# EAGLE design TAStm32 (EAGLE 9.1.3)
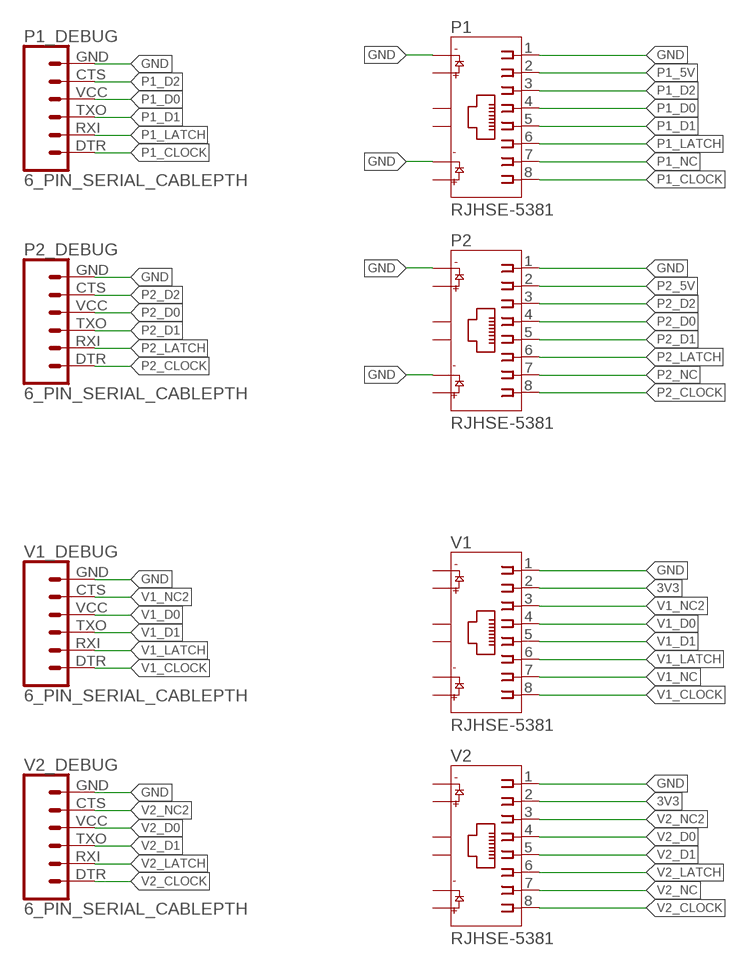
[diagram p0: schematic, sheet 1, part 1 of 2]
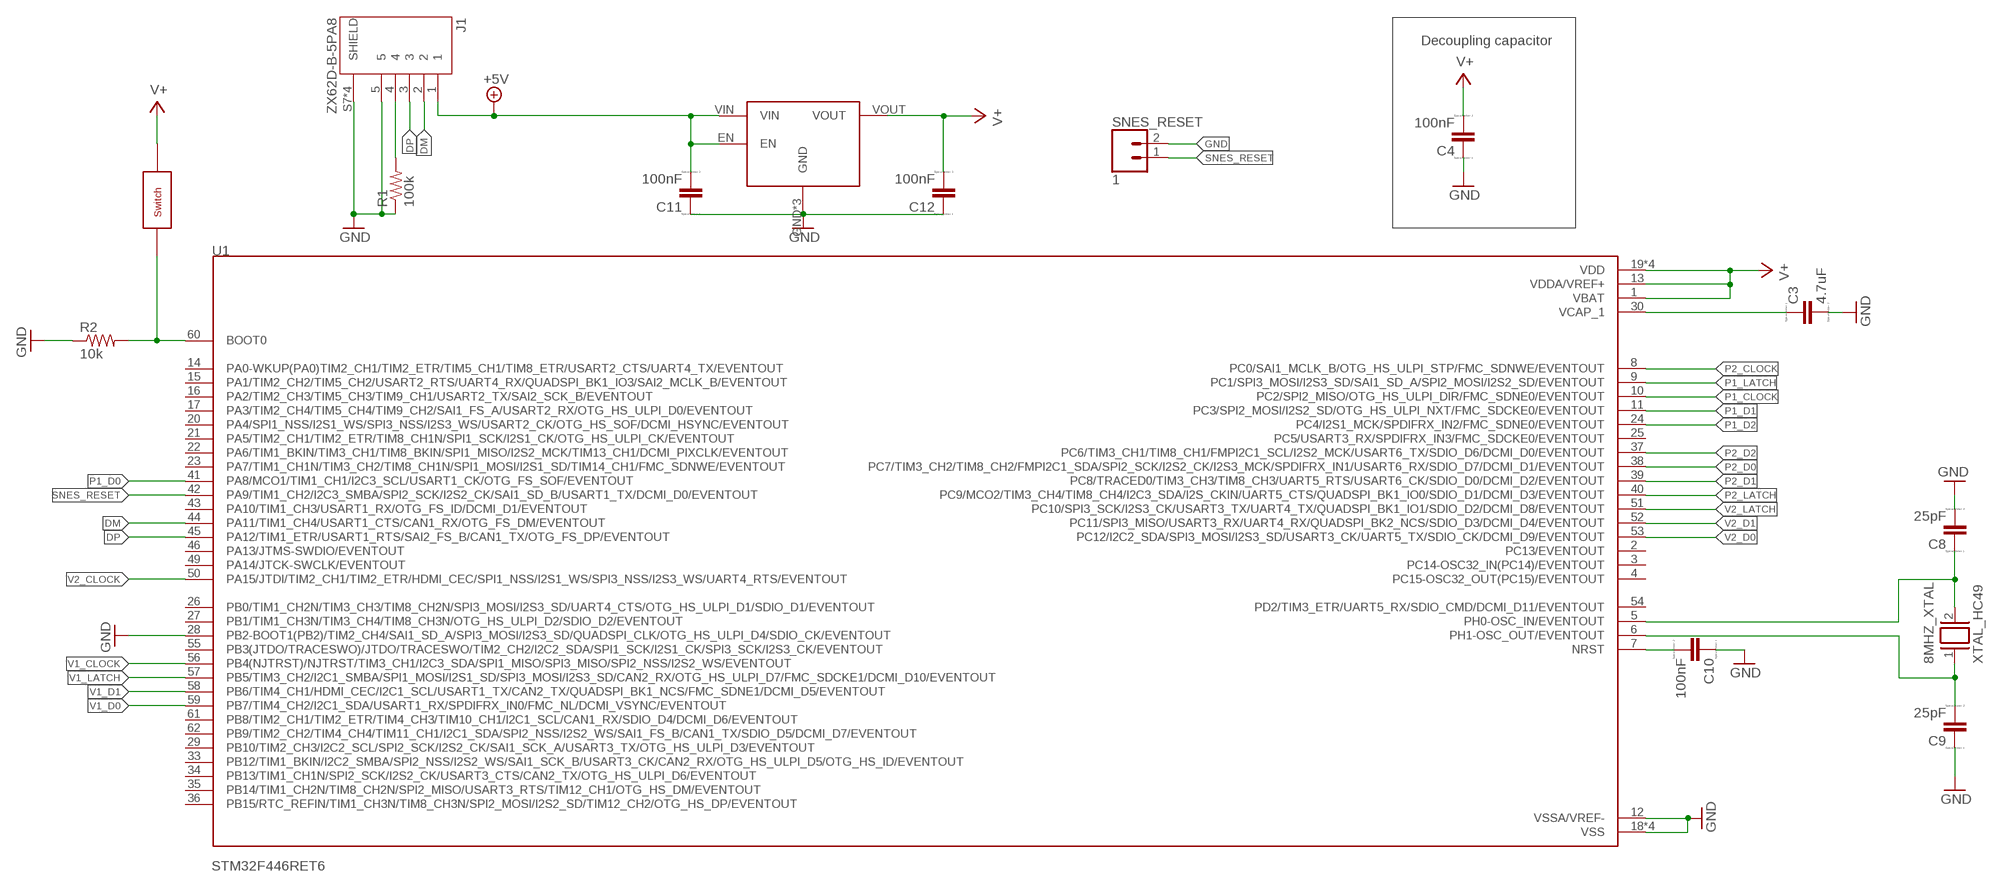
[diagram p1: schematic, sheet 1, part 2 of 2]

## Parts
8MHZ_XTAL  XTAL_HC49  [XTAL_HC49P488W45L1150T500H350]
C3  4.7uF  C  [C0805]
C4  100nF  C  [C0805]
C8  25pF  C  [C0805]
C9  25pF  C  [C0805]
C10  100nF  C  [C0805]
C11  100nF  C  [C0805]
C12  100nF  C  [C0805]
J1  ZX62D-B-5PA8  [HIROSE_ZX62D-B-5PA8]
P1  RJHSE-5381  [AMPHENOL_RJHSE-5381]
P1_DEBUG  6_PIN_SERIAL_CABLEPTH  [FTDI_BASIC]
P2  RJHSE-5381  [AMPHENOL_RJHSE-5381]
P2_DEBUG  6_PIN_SERIAL_CABLEPTH  [FTDI_BASIC]
R1  100k  R-US_R0805  [R0805]
R2  10k  R-US_R0805  [R0805]
SNES_RESET  1  CONN_02  [1X02]
SWITCH  DM01  [DM01]
U1  STM32F446RET6  [QFP50P1200X1200X160-64N]
V1  RJHSE-5381  [AMPHENOL_RJHSE-5381]
V1_DEBUG  6_PIN_SERIAL_CABLEPTH  [FTDI_BASIC]
V2  RJHSE-5381  [AMPHENOL_RJHSE-5381]
V2_DEBUG  6_PIN_SERIAL_CABLEPTH  [FTDI_BASIC]
V_REG  S-1172B33-U5T1G  [S-1172B33-U5T1G]

## Nets
3V3: C4.2 C12.2 SWITCH.P$1 U1.1(VBAT) U1.13(VDDA/VREF+) U1.19(VDD) U1.32(VDD) U1.48(VDD) U1.64(VDD) V1.2 V2.2 V_REG.VOUT ; supply symbol labelled V+
+5V: C11.2 J1.1 V_REG.EN V_REG.VIN
DM: J1.2 U1.44(PA11/TIM1_CH4/USART1_CTS/CAN1_RX/OTG_FS_DM/EVENTOUT)
DP: J1.3 U1.45(PA12/TIM1_ETR/USART1_RTS/SAI2_FS_B/CAN1_TX/OTG_FS_DP/EVENTOUT)
GND: C3.2 C4.1 C8.2 C9.1 C10.1 C11.1 C12.1 J1.5 J1.S7(SHIELD) J1.S8(SHIELD) J1.S9(SHIELD) J1.S10(SHIELD) P1.1 P1.9 P1.11 P1_DEBUG.GND P2.1 P2.9 P2.11 P2_DEBUG.GND R1.1 R2.1 SNES_RESET.2 U1.12(VSSA/VREF-) U1.18(VSS) U1.28(PB2-BOOT1(PB2)/TIM2_CH4/SAI1_SD_A/SPI3_MOSI/I2S3_SD/QUADSPI_CLK/OTG_HS_ULPI_D4/SDIO_CK/EVENTOUT) U1.31(VSS) U1.47(VSS) U1.63(VSS) V1.1 V1_DEBUG.GND V2.1 V2_DEBUG.GND V_REG.GND V_REG.GND2(GND) V_REG.GND3(GND)
N$3: R2.2 SWITCH.P$2 U1.60(BOOT0)
N$4: C10.2 U1.7(NRST)
N$6: C3.1 U1.30(VCAP_1)
N$15: J1.4 R1.2
P1_5V: P1.2
P1_CLOCK: P1.8 P1_DEBUG.DTR U1.10(PC2/SPI2_MISO/OTG_HS_ULPI_DIR/FMC_SDNE0/EVENTOUT)
P1_D0: P1.4 P1_DEBUG.VCC U1.41(PA8/MCO1/TIM1_CH1/I2C3_SCL/USART1_CK/OTG_FS_SOF/EVENTOUT)
P1_D1: P1.5 P1_DEBUG.TXO U1.11(PC3/SPI2_MOSI/I2S2_SD/OTG_HS_ULPI_NXT/FMC_SDCKE0/EVENTOUT)
P1_D2: P1.3 P1_DEBUG.CTS U1.24(PC4/I2S1_MCK/SPDIFRX_IN2/FMC_SDNE0/EVENTOUT)
P1_LATCH: P1.6 P1_DEBUG.RXI U1.9(PC1/SPI3_MOSI/I2S3_SD/SAI1_SD_A/SPI2_MOSI/I2S2_SD/EVENTOUT)
P1_NC: P1.7
P2_5V: P2.2
P2_CLOCK: P2.8 P2_DEBUG.DTR U1.8(PC0/SAI1_MCLK_B/OTG_HS_ULPI_STP/FMC_SDNWE/EVENTOUT)
P2_D0: P2.4 P2_DEBUG.VCC U1.38(PC7/TIM3_CH2/TIM8_CH2/FMPI2C1_SDA/SPI2_SCK/I2S2_CK/I2S3_MCK/SPDIFRX_IN1/USART6_RX/SDIO_D7/DCMI_D1/EVENTOUT)
P2_D1: P2.5 P2_DEBUG.TXO U1.39(PC8/TRACED0/TIM3_CH3/TIM8_CH3/UART5_RTS/USART6_CK/SDIO_D0/DCMI_D2/EVENTOUT)
P2_D2: P2.3 P2_DEBUG.CTS U1.37(PC6/TIM3_CH1/TIM8_CH1/FMPI2C1_SCL/I2S2_MCK/USART6_TX/SDIO_D6/DCMI_D0/EVENTOUT)
P2_LATCH: P2.6 P2_DEBUG.RXI U1.40(PC9/MCO2/TIM3_CH4/TIM8_CH4/I2C3_SDA/I2S_CKIN/UART5_CTS/QUADSPI_BK1_IO0/SDIO_D1/DCMI_D3/EVENTOUT)
P2_NC: P2.7
SNES_RESET: SNES_RESET.1 U1.42(PA9/TIM1_CH2/I2C3_SMBA/SPI2_SCK/I2S2_CK/SAI1_SD_B/USART1_TX/DCMI_D0/EVENTOUT)
V1_CLOCK: U1.56(PB4(NJTRST)/NJTRST/TIM3_CH1/I2C3_SDA/SPI1_MISO/SPI3_MISO/SPI2_NSS/I2S2_WS/EVENTOUT) V1.8 V1_DEBUG.DTR
V1_D0: U1.59(PB7/TIM4_CH2/I2C1_SDA/USART1_RX/SPDIFRX_IN0/FMC_NL/DCMI_VSYNC/EVENTOUT) V1.4 V1_DEBUG.VCC
V1_D1: U1.58(PB6/TIM4_CH1/HDMI_CEC/I2C1_SCL/USART1_TX/CAN2_TX/QUADSPI_BK1_NCS/FMC_SDNE1/DCMI_D5/EVENTOUT) V1.5 V1_DEBUG.TXO
V1_LATCH: U1.57(PB5/TIM3_CH2/I2C1_SMBA/SPI1_MOSI/I2S1_SD/SPI3_MOSI/I2S3_SD/CAN2_RX/OTG_HS_ULPI_D7/FMC_SDCKE1/DCMI_D10/EVENTOUT) V1.6 V1_DEBUG.RXI
V1_NC: V1.7
V1_NC2: V1.3 V1_DEBUG.CTS
V2_CLOCK: U1.50(PA15/JTDI/TIM2_CH1/TIM2_ETR/HDMI_CEC/SPI1_NSS/I2S1_WS/SPI3_NSS/I2S3_WS/UART4_RTS/EVENTOUT) V2.8 V2_DEBUG.DTR
V2_D0: U1.53(PC12/I2C2_SDA/SPI3_MOSI/I2S3_SD/USART3_CK/UART5_TX/SDIO_CK/DCMI_D9/EVENTOUT) V2.4 V2_DEBUG.VCC
V2_D1: U1.52(PC11/SPI3_MISO/USART3_RX/UART4_RX/QUADSPI_BK2_NCS/SDIO_D3/DCMI_D4/EVENTOUT) V2.5 V2_DEBUG.TXO
V2_LATCH: U1.51(PC10/SPI3_SCK/I2S3_CK/USART3_TX/UART4_TX/QUADSPI_BK1_IO1/SDIO_D2/DCMI_D8/EVENTOUT) V2.6 V2_DEBUG.RXI
V2_NC: V2.7
V2_NC2: V2.3 V2_DEBUG.CTS
XTAL1: 8MHZ_XTAL.2 C8.1 U1.5(PH0-OSC_IN/EVENTOUT)
XTAL2: 8MHZ_XTAL.1 C9.2 U1.6(PH1-OSC_OUT/EVENTOUT)
Unconnected: P1.10 P1.12 P1.S1 P1.S2 P2.10 P2.12 P2.S1 P2.S2 U1.2(PC13/EVENTOUT) U1.3(PC14-OSC32_IN(PC14)/EVENTOUT) U1.4(PC15-OSC32_OUT(PC15)/EVENTOUT) U1.14(PA0-WKUP(PA0)TIM2_CH1/TIM2_ETR/TIM5_CH1/TIM8_ETR/USART2_CTS/UART4_TX/EVENTOUT) U1.15(PA1/TIM2_CH2/TIM5_CH2/USART2_RTS/UART4_RX/QUADSPI_BK1_IO3/SAI2_MCLK_B/EVENTOUT) U1.16(PA2/TIM2_CH3/TIM5_CH3/TIM9_CH1/USART2_TX/SAI2_SCK_B/EVENTOUT) U1.17(PA3/TIM2_CH4/TIM5_CH4/TIM9_CH2/SAI1_FS_A/USART2_RX/OTG_HS_ULPI_D0/EVENTOUT) U1.20(PA4/SPI1_NSS/I2S1_WS/SPI3_NSS/I2S3_WS/USART2_CK/OTG_HS_SOF/DCMI_HSYNC/EVENTOUT) U1.21(PA5/TIM2_CH1/TIM2_ETR/TIM8_CH1N/SPI1_SCK/I2S1_CK/OTG_HS_ULPI_CK/EVENTOUT) U1.22(PA6/TIM1_BKIN/TIM3_CH1/TIM8_BKIN/SPI1_MISO/I2S2_MCK/TIM13_CH1/DCMI_PIXCLK/EVENTOUT) U1.23(PA7/TIM1_CH1N/TIM3_CH2/TIM8_CH1N/SPI1_MOSI/I2S1_SD/TIM14_CH1/FMC_SDNWE/EVENTOUT) U1.25(PC5/USART3_RX/SPDIFRX_IN3/FMC_SDCKE0/EVENTOUT) U1.26(PB0/TIM1_CH2N/TIM3_CH3/TIM8_CH2N/SPI3_MOSI/I2S3_SD/UART4_CTS/OTG_HS_ULPI_D1/SDIO_D1/EVENTOUT) U1.27(PB1/TIM1_CH3N/TIM3_CH4/TIM8_CH3N/OTG_HS_ULPI_D2/SDIO_D2/EVENTOUT) U1.29(PB10/TIM2_CH3/I2C2_SCL/SPI2_SCK/I2S2_CK/SAI1_SCK_A/USART3_TX/OTG_HS_ULPI_D3/EVENTOUT) U1.33(PB12/TIM1_BKIN/I2C2_SMBA/SPI2_NSS/I2S2_WS/SAI1_SCK_B/USART3_CK/CAN2_RX/OTG_HS_ULPI_D5/OTG_HS_ID/EVENTOUT) U1.34(PB13/TIM1_CH1N/SPI2_SCK/I2S2_CK/USART3_CTS/CAN2_TX/OTG_HS_ULPI_D6/EVENTOUT) U1.35(PB14/TIM1_CH2N/TIM8_CH2N/SPI2_MISO/USART3_RTS/TIM12_CH1/OTG_HS_DM/EVENTOUT) U1.36(PB15/RTC_REFIN/TIM1_CH3N/TIM8_CH3N/SPI2_MOSI/I2S2_SD/TIM12_CH2/OTG_HS_DP/EVENTOUT) U1.43(PA10/TIM1_CH3/USART1_RX/OTG_FS_ID/DCMI_D1/EVENTOUT) U1.46(PA13/JTMS-SWDIO/EVENTOUT) U1.49(PA14/JTCK-SWCLK/EVENTOUT) U1.54(PD2/TIM3_ETR/UART5_RX/SDIO_CMD/DCMI_D11/EVENTOUT) U1.55(PB3(JTDO/TRACESWO)/JTDO/TRACESWO/TIM2_CH2/I2C2_SDA/SPI1_SCK/I2S1_CK/SPI3_SCK/I2S3_CK/EVENTOUT) U1.61(PB8/TIM2_CH1/TIM2_ETR/TIM4_CH3/TIM10_CH1/I2C1_SCL/CAN1_RX/SDIO_D4/DCMI_D6/EVENTOUT) U1.62(PB9/TIM2_CH2/TIM4_CH4/TIM11_CH1/I2C1_SDA/SPI2_NSS/I2S2_WS/SAI1_FS_B/CAN1_TX/SDIO_D5/DCMI_D7/EVENTOUT) V1.9 V1.10 V1.11 V1.12 V1.S1 V1.S2 V2.9 V2.10 V2.11 V2.12 V2.S1 V2.S2

## Notes on the sheet
- Decoupling capacitor

## Library data of the parts
8MHZ_XTAL = XTAL_HC49P488W45L1150T500H350:XTAL_HC49
C3 C4 C8-C12 = eagle-ltspice:C: CAPACITOR, European symbol; SPICEMODEL: NONE; SPICEPREFIX: C
J1 = ZX62D-B-5PA8:ZX62D-B-5PA8: CONN RCPT USB; AVAILABILITY: Unavailable; DESCRIPTION: 5 Pin Single Port USB 2.0 Micro B Bottom Mount Through Hole Receptacle Male; MF: Hirose; MP: ZX62D-B-5PA8; PACKAGE: None; PRICE: None
P1 P2 V1 V2 = RJHSE-5381:RJHSE-5381: connector, mod jack, rt angle pcb, shielded, led1-g, led2-y, single port, rj-45 8 cont; AVAILABILITY: Unavailable; DESCRIPTION: connector, mod jack, rt angle pcb, shielded, led1-g, led2-y, single port, rj-45 8 cont; MF: Amphenol ICC; MP: RJHSE-5381; PACKAGE: None; PRICE: None
P1_DEBUG P2_DEBUG V1_DEBUG V2_DEBUG = SparkFun-Connectors:6_PIN_SERIAL_CABLE: 6-pin header connection for use with the "FTDI BASIC" pinout - CABLE SIDE. Also known as "Arduino Serial Program Header". This is used on a design to provide a 6-pin connection point for serial communication usually from a USB cable (D+/D-) to these headers (RX/TX). It also has the remaining pins necessary for programming in the Arduino evironment (DTR, GND, and sometimes VCC). Note, this device has "CABLE" in the name. It is intended to be used on a design that usually lives on the end of your USB cable and prvides the converter chip (FTDI232 or FTDI231x) to commnicate serial RX/TX. The "sister" device, named "TARGET" is inteneded to be used on a design that contains a target micro-controller that you wish to program. You can populate with some of these: Female Headers <https://www.sparkfun.com/products/115> (PRT-00115) For reference (or to suit your programming needs) check out these designs: SparkFun FTDI Basic Breakout - 5V <https://www.sparkfun.com/products/9716> (DEV-09716) SparkFun FTDI Basic Breakout - 3.3V <https://www.sparkfun.com/products/9873> (DEV-09873) SparkFun FTDI SmartBasic <https://www.sparkfun.com/products/12935> (DEV-12935) SparkFun Beefy 3 - FTDI Basic Breakout <https://www.sparkfun.com/products/13746> (DEV-13746)
R1 R2 = rcl:R-US_: RESISTOR, American symbol; SPICEPREFIX: R
SNES_RESET = SparkFun-Connectors:CONN_02: Multi connection point. Often used as Generic Header-pin footprint for 0.1 inch spaced/style header connections On any of the 0.1 inch spaced packages, you can populate with these: Break Away Headers - Straight <https://www.sparkfun.com/products/116> (PRT-00116) Break Away Male Headers - Right Angle <https://www.sparkfun.com/products/553> (PRT-00553) Female Headers <https://www.sparkfun.com/products/115> (PRT-00115) Break Away Headers - Machine Pin <https://www.sparkfun.com/products/117> (PRT-00117) Break Away Female Headers - Swiss Machine Pin <https://www.sparkfun.com/products/743> (PRT-00743) For SCREWTERMINALS and SPRING TERMINALS visit here: Screw Terimnals on SparkFun.com <https://www.sparkfun.com/search/results?term=Screw+Terminals> (5mm/3.5mm/2.54mm spacing) This device is also useful as a general connection point to wire up your design to another part of your project. Our various solder wires solder well into these plated through hole pads. Hook-Up Wire - Assortment (Stranded, 22 AWG) <https://www.sparkfun.com/products/11375> (PRT-11375) Hook-Up Wire - Assortment (Solid Core, 22 AWG) <https://www.sparkfun.com/products/11367> (PRT-11367) View the entire wire category on our website here <https://www.sparkfun.com/categories/141> Special notes: Molex polarized connector foot print use with: PRT-08233 with associated crimp pins and housings. 2.54_SCREWTERM for use with PRT-10571. 3.5mm Screw Terminal footprints for PRT-08084 5mm Screw Terminal footprints for use with PRT-08432
SWITCH = DM01:DM01
U1 = STM32F446RET6:STM32F446RET6: MCU 32-Bit STM32 ARM Cortex M4 RISC 512KB Flash 2.5V/3.3V 64-Pin LQFP Tray; DESCRIPTION: MCU 32-Bit STM32 ARM Cortex M4 RISC 512KB Flash 2.5V/3.3V 64-Pin LQFP Tray; MF: STMicroelectronics; MP: STM32F446RET6; PACKAGE: LQFP-64 STMicroelectronics
V_REG = S-1172B33-U5T1G:S-1172B33-U5T1G

## Board
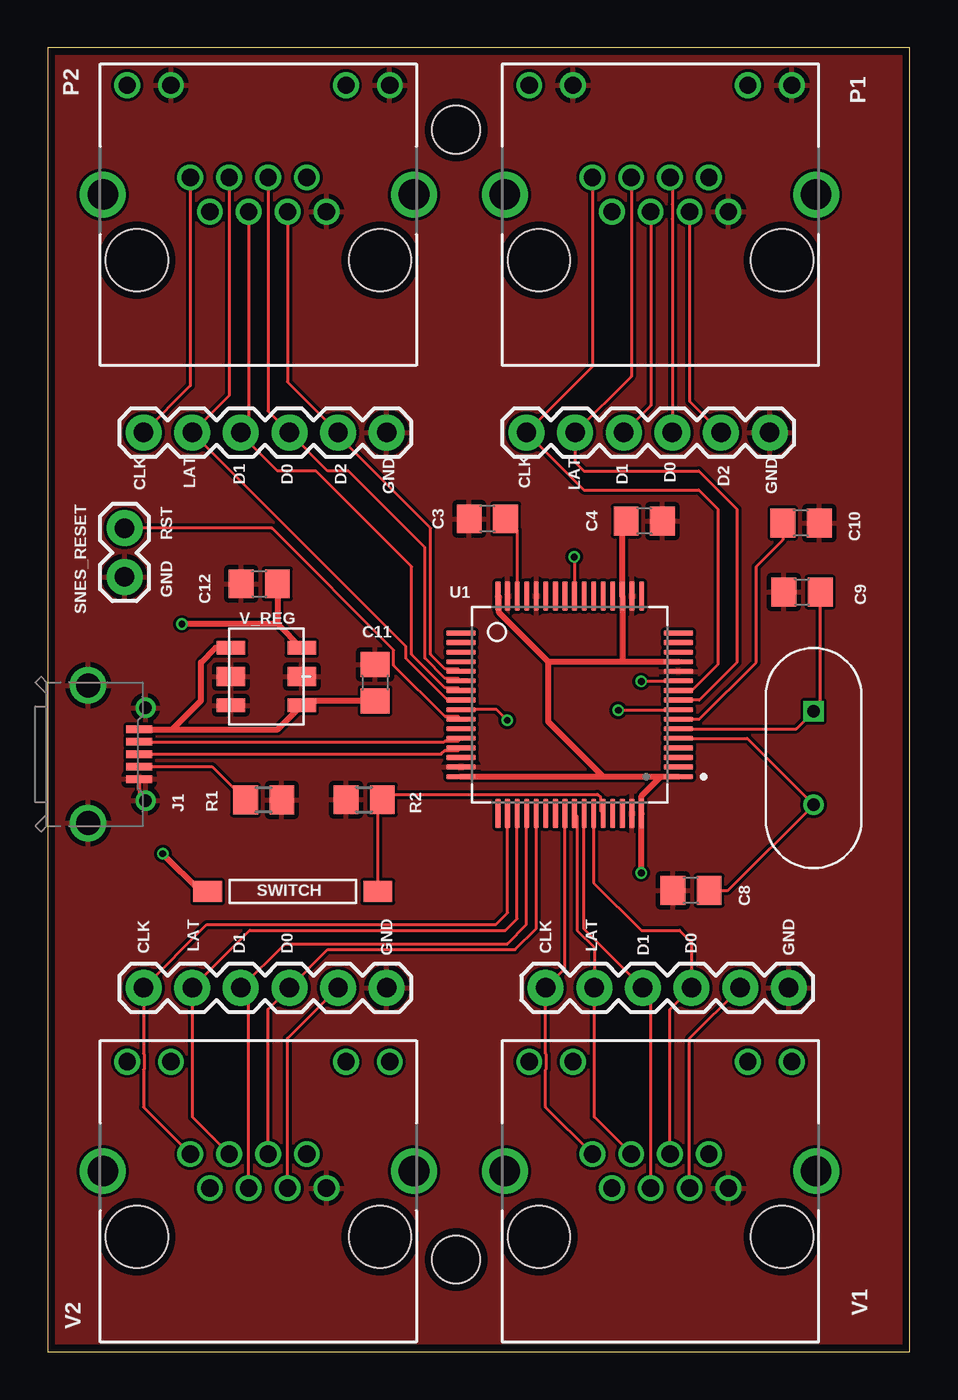
[diagram p2: board, top side]
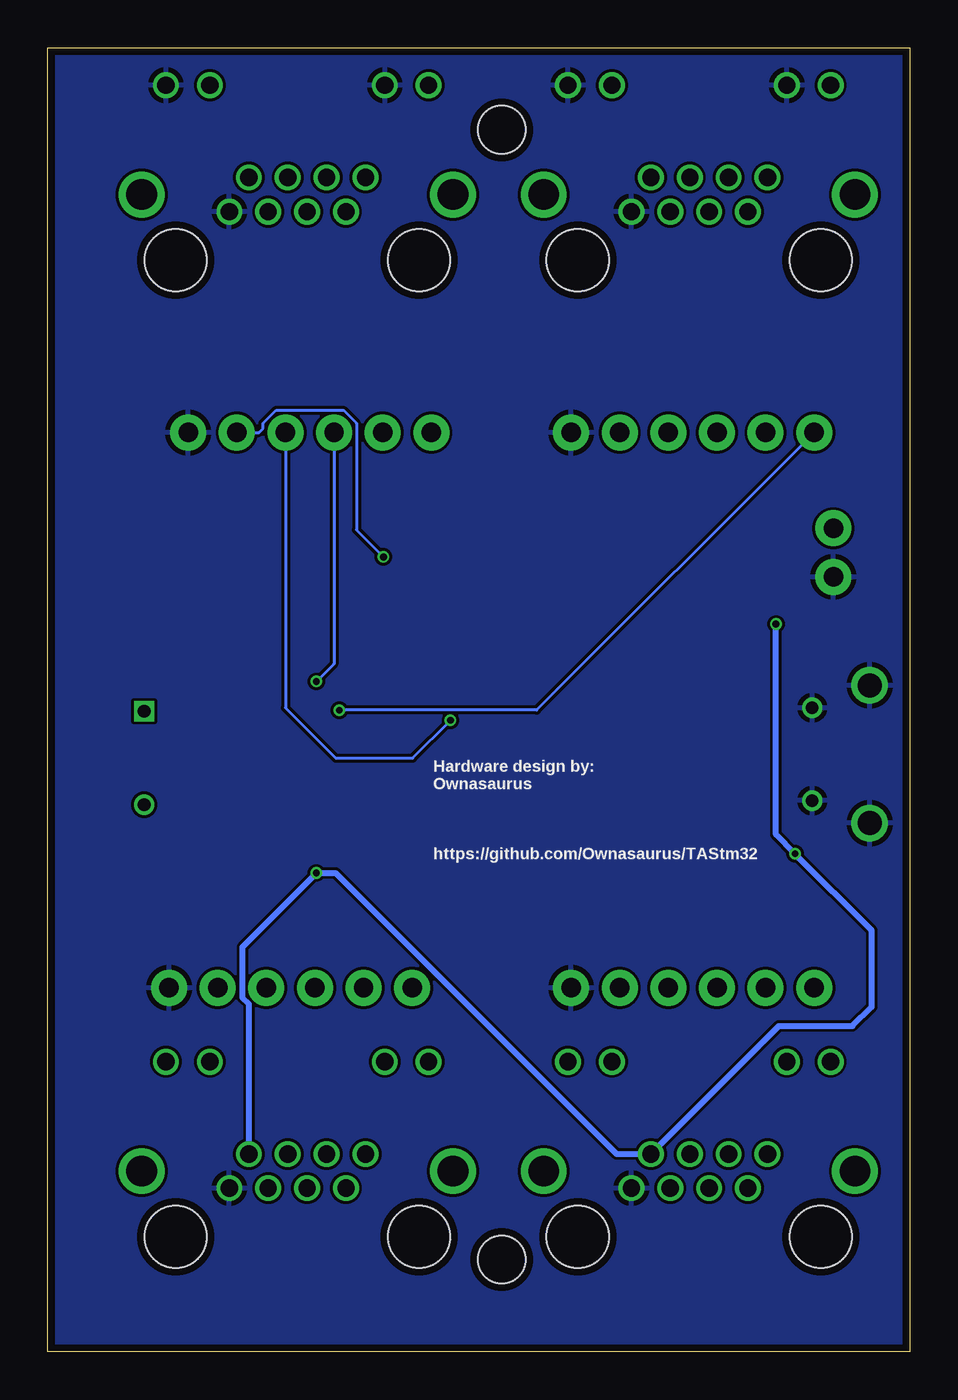
[diagram p3: board, bottom side, seen from below]

Size 45.03 x 68.09 mm. Coordinates in mm from the lower left corner, seen from the top.
Outline: 0,0 45.03,0 45.03,68.09 0,68.09 0,0
Copper layers (1*16): Top 0.035559375mm / dielectric 1.6mm / Bottom 0.035559375mm
Design rules "oshpark-2layer *": minimum track width 6mil, minimum drill 10mil, track to track 6mil, track to pad 6mil, pad to pad 6mil, via to via 6mil, smd to smd 6mil, copper to edge 15mil, drill to drill 6mil, minimum pad ring 5mil, minimum via ring 5mil, stop-mask expansion 2.5mil, vias tented up to drill 25mil, thermal gap 10mil
Holes 2.5 mm at 21.32,4.81 21.32,63.81

### Footprints (pad centres in the part's own frame; a part is rotated, then mirrored left to right if it is on the bottom)
XTAL_HC49P488W45L1150T500H350 = drill 0.66 pad 1.06 square: 1 -2.44,0 | drill 0.66 pad 1.06: 2 2.44,0
C0805 = smd 1.3 x 1.5: 1 -0.95,0; 2 0.95,0
HIROSE_ZX62D-B-5PA8 = smd 1.35 x 0.4: 1 2.675,1.3; 2 2.675,0.65; 3 2.675,0; 4 2.675,-0.65; 5 2.675,-1.3 | drill 0.65 pad 1.05: S7 3,2.425; S8 3,-2.425 | drill 1.25 pad 1.9: S9 0,3.6; S10 0,-3.6
AMPHENOL_RJHSE-5381 = drill 0.9: 1 3.55,2.54; 2 2.53,4.32; 3 1.52,2.54; 4 0.5,4.32; 5 -0.51,2.54; 6 -1.53,4.32; 7 -2.54,2.54; 8 -3.56,4.32; 9 6.86,9.14; 10 4.57,9.14; 11 -4.57,9.14; 12 -6.86,9.14 | drill 1.6: S1 8.13,3.43; S2 -8.13,3.43 | hole 3.25: 6.35,0; -6.35,0
FTDI_BASIC = drill 1.016 pad 1.88: CTS 10.16,0; DTR 0,0; GND 12.7,0; RXI 2.54,0; TXO 5.08,0; VCC 7.62,0
R0805 = smd 1.3 x 1.5: 1 -0.95,0; 2 0.95,0
1X02 = drill 1.016 pad 1.88: 1 0,0; 2 2.54,0
DM01 = smd 1.1 x 1.5: P$1 0,4.45; P$2 0,-4.45
QFP50P1200X1200X160-64N = smd 1.56 x 0.28: 1 -5.68,3.75; 2 -5.68,3.25; 3 -5.68,2.75; 4 -5.68,2.25; 5 -5.68,1.75; 6 -5.68,1.25; 7 -5.68,0.75; 8 -5.68,0.25; 9 -5.68,-0.25; 10 -5.68,-0.75; 11 -5.68,-1.25; 12 -5.68,-1.75; 13 -5.68,-2.25; 14 -5.68,-2.75; 15 -5.68,-3.25; 16 -5.68,-3.75; 33 5.68,-3.75; 34 5.68,-3.25; 35 5.68,-2.75; 36 5.68,-2.25; 37 5.68,-1.75; 38 5.68,-1.25; 39 5.68,-0.75; 40 5.68,-0.25; 41 5.68,0.25; 42 5.68,0.75; 43 5.68,1.25; 44 5.68,1.75; 45 5.68,2.25; 46 5.68,2.75; 47 5.68,3.25; 48 5.68,3.75 | smd 0.28 x 1.56: 17 -3.75,-5.68; 18 -3.25,-5.68; 19 -2.75,-5.68; 20 -2.25,-5.68; 21 -1.75,-5.68; 22 -1.25,-5.68; 23 -0.75,-5.68; 24 -0.25,-5.68; 25 0.25,-5.68; 26 0.75,-5.68; 27 1.25,-5.68; 28 1.75,-5.68; 29 2.25,-5.68; 30 2.75,-5.68; 31 3.25,-5.68; 32 3.75,-5.68; 49 3.75,5.68; 50 3.25,5.68; 51 2.75,5.68; 52 2.25,5.68; 53 1.75,5.68; 54 1.25,5.68; 55 0.75,5.68; 56 0.25,5.68; 57 -0.25,5.68; 58 -0.75,5.68; 59 -1.25,5.68; 60 -1.75,5.68; 61 -2.25,5.68; 62 -2.75,5.68; 63 -3.25,5.68; 64 -3.75,5.68
S-1172B33-U5T1G = smd 0.7 x 1.5: EN -1.5,-1.85; GND3 1.5,-1.85; VIN 1.5,1.85; VOUT -1.5,1.85 | smd 1 x 1.5: GND 0,-1.85; GND2 0,1.85

### Placement (x,y rotation side)
8MHZ_XTAL  40,31 270 top
C3  22.96,43.49 180 top
C4  31.16,43.38 180 top
C8  33.59,24.09 180 top
C9  39.39,39.67 0 top
C10  39.34,43.27 180 top
C11  17.09,34.94 270 top
C12  11.04,40.1 0 top
J1  2.1,31.2 0 top
P1  32,57 0 top
P1_DEBUG  25,48 0 top
P2  11,57 0 top
P2_DEBUG  5,48 0 top
R1  11.27,28.81 180 top
R2  16.52,28.83 0 top
SNES_RESET  4,43 270 top
SWITCH  12.79,24.03 90 top
U1  27.26,33.78 180 top
V1  32,6 0 top
V1_DEBUG  26,19 0 top
V2  11,6 0 top
V2_DEBUG  5,19 0 top
V_REG  11.41,35.25 270 top

### Tracks (layer width: path | path; a pad name or v marks a point on that pad's centre or on a via)
3V3  (via drill 0.35)
  Top 0.305: C12.2 11.99,38.02 | 11.99,38.02 V_REG.VOUT | v6,26 7.97,24.03 SWITCH.P$1 | v7,38 7.02,38.02 11.99,38.02 | 23.57,38.59 23.58,38.58 | 23.58,38.58 26.13,36.03 | 26.13,36.03 30,36.03 | 30,36.03 U1.13 | 30,36.03 U1.19 30.01,43.18 C4.2 | 32.03,30.03 U1.1 | 32.03,30.03 31.01,29.01 U1.64 v31,25 | U1.48 29,30.03 | 29,30.03 32.03,30.03 | 26.13,36.03 26.13,32.9 29,30.03 | 23.58,38.58 23.57,38.59 | 23.57,38.59 23.57,39.41 U1.32
  Bottom 0.305: v7,38 7,27 v6,26 2,22 2,18 3,17 6.85,17 V2.2 15.32,10.32 30,25 v31,25 34.87,21.14 34.87,18.48 34.53,18.15 V1.2
+5V
  Top 0.305: 6.5,32.5 8,34 8,36 8.75,36.75 V_REG.EN | 6.5,32.5 12.01,32.5 V_REG.VIN 13.5,33.99 C11.2 | J1.1 6.5,32.5
DM
  Top 0.152: J1.2 20.7,31.85 20.75,31.9 21.45,31.9 U1.44
DP
  Top 0.152: U1.45 21.45,31.4 20.75,31.4 20.55,31.2 J1.3
GND
  Top 0.152: J1.5 4.78,29.1 J1.S8
  pour Bottom: 0,68.1 45.36,68.1 45.36,0 0,0
  pour Top: 0,68 45,68 45,0 0,0
N$3
  Top 0.152: U1.60 28.88,28.23 28.88,28.93 28.7,29.11 17.75,29.11 R2.2 17.24,28.6 SWITCH.P$2
N$4
  Top 0.152: U1.7 34.03,33.03 37,36 37,41 38.39,42.39 C10.2
N$6
  Top 0.152: C3.1 24.51,42.89 U1.30
N$15
  Top 0.152: J1.4 8.58,30.55 R1.2
P1_CLOCK
  Top 0.152: P1.8 28.44,51.44 P1_DEBUG.DTR 28,45 34,45 35,44 35,35.89 33.64,34.53 U1.10
P1_D0  (via drill 0.35)
  Top 0.152: P1.4 32.62,61.2 32.62,59.92 32.62,59.91 32.62,59.17 32.62,59.16 P1_DEBUG.VCC | v24,32.97 23.44,33.53 U1.41
  Bottom 0.152: P1_DEBUG.VCC 32.62,33.62 30,31 25.97,31 v24,32.97
P1_D1  (via drill 0.35)
  Top 0.152: P1.5 31.49,49.41 P1_DEBUG.TXO | v31,35 31.03,35.03 U1.11
  Bottom 0.152: P1_DEBUG.TXO 30.08,35.92 v31,35
P1_D2  (via drill 0.35)
  Top 0.152: P1.3 33.52,49.64 P1_DEBUG.CTS | v27.5,41.5 U1.24
  Bottom 0.152: P1_DEBUG.CTS 34,48 33.79,48.21 33.79,48.48 33.1,49.17 29.6,49.17 28.91,48.48 28.91,42.91 v27.5,41.5
P1_LATCH
  Top 0.152: P1.6 30.47,50.93 P1_DEBUG.RXI 27.54,46.46 28,46 34,46 36,44 36,36 34.03,34.03 U1.9
P2_CLOCK  (via drill 0.35)
  Top 0.152: P2.8 7.44,50.44 P2_DEBUG.DTR | v29.8,33.5 32.91,33.5 U1.8
  Bottom 0.152: P2_DEBUG.DTR 19.5,33.5 v29.8,33.5
P2_D0
  Top 0.152: P2.4 11.5,49.12 P2_DEBUG.VCC 14.62,46 15.7,46 19.7,42 19.7,36.21 20.75,35.16 21.45,35.16 U1.38
P2_D1
  Top 0.152: P2.5 10.49,48.41 P2_DEBUG.TXO 10.08,47.92 12,46 14,46 19,41 19,36.41 20.75,34.66 21.45,34.66 U1.39
P2_D2
  Top 0.152: P2.3 12.52,50.64 15.08,48.08 | 15.08,48.08 P2_DEBUG.CTS | U1.37 21.45,35.66 20.75,35.66 20,36.41 20,43 15.08,47.92 15.08,48.08
P2_LATCH
  Top 0.152: P2.6 9.47,49.93 P2_DEBUG.RXI 18.7,36.84 18.7,36.21 20.88,34.03 U1.40
SNES_RESET
  Top 0.152: U1.42 21.45,33.16 20.75,33.16 18.07,35.84 18.07,36.63 11.7,43 SNES_RESET.1
V1_CLOCK
  Top 0.152: V1.8 26,12.76 26,14.72 26.04,14.77 26.04,15.51 26,15.56 V1_DEBUG.DTR 27.01,20.01 U1.56
V1_D0
  Top 0.152: V1.4 32.5,17.88 V1_DEBUG.VCC 33.62,21.38 33,22 31,22 28.51,24.49 U1.59
V1_D1
  Top 0.152: V1.5 31.49,18.59 V1_DEBUG.TXO 28.01,22.07 U1.58
V1_LATCH
  Top 0.152: V1.6 28.54,12.25 V1_DEBUG.RXI 28.54,21.11 27.64,22.01 27.64,27.97 U1.57
V1_NC2
  Top 0.152: V1.3 33.52,16.36 V1_DEBUG.CTS
V2_CLOCK
  Top 0.152: V2.8 5,12.76 5,14.72 5.04,14.77 5.04,15.51 5,15.56 V2_DEBUG.DTR 8.3,22.3 23.4,22.3 24.01,22.91 U1.50
V2_D0
  Top 0.152: V2.4 11.5,17.88 V2_DEBUG.VCC 14.62,21 24.4,21 25.51,22.11 U1.53
V2_D1
  Top 0.152: V2.5 10.49,18.59 V2_DEBUG.TXO 12.38,21.3 24,21.3 25,22.3 U1.52
V2_LATCH
  Top 0.152: V2.6 7.54,12.25 V2_DEBUG.RXI 10.54,22 23.9,22 24.51,22.61 U1.51
V2_NC2
  Top 0.152: V2.3 12.52,16.36 V2_DEBUG.CTS
XTAL1
  Top 0.152: C8.1 35.53,24.09 8MHZ_XTAL.2 36.53,32.03 U1.5
XTAL2
  Top 0.152: C9.2 40.34,33.78 8MHZ_XTAL.1 39.09,32.53 U1.6

### Text on the board
tNames: CLK | LAT | D1 | D0 | D2 | GND | CLK | LAT | D1 | D0 | D2 | GND | RST | GND | V_REG | SWITCH | CLK | LAT | D1 | D0 | GND | CLK | LAT | D1 | D0 | GND
bNames: Hardware design by: / Ownasaurus / / / / https://github.com/Ownasaurus/TAStm32